# Altium schematic sheet MCU.SchDoc
size A4
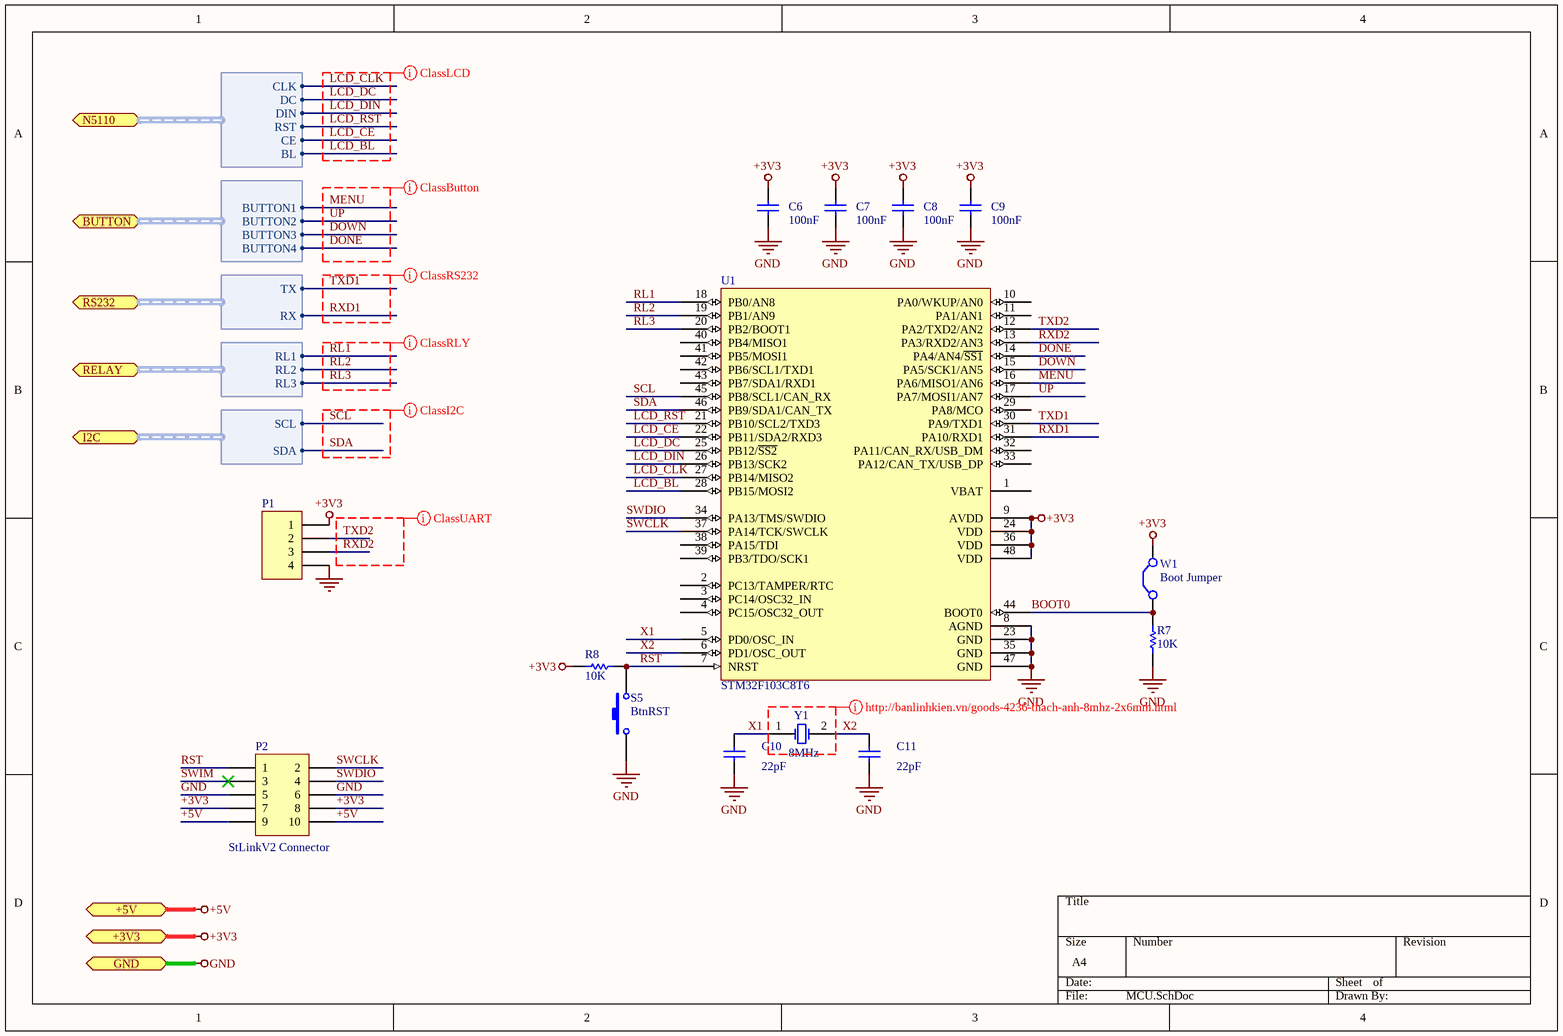
[diagram p0: MCU.SchDoc]

## Parts
C6  value 100nF  [C-0805]  (hidden comment: 104)
C7  value 100nF  [C-0805]  (hidden comment: 104)
C8  value 100nF  [C-0805]  (hidden comment: 104)
C9  value 100nF  [C-0805]  (hidden comment: 104)
C10  value 22pF  [C-0805]  (hidden comment: 22)
C11  value 22pF  [C-0805]  (hidden comment: 22)
P1  XH2.54-4P  [CONN-XH2.54-4P]  (value not drawn)
P2  value StLinkV2 Connector  [CONN-IDC-5X2-A]  (hidden comment: IDC5x2A)
R7  10K  [R-0805]
R8  10K  [R-0805]
S5  value BtnRST  [SW-T-S6]  (hidden comment: SW-T-S6)
U1  STM32F103C8T6  [LQFP-48]
W1  value Boot Jumper  [JP2.54-M-1x02A]  (hidden comment: JP2.54-M)
Y1  value 8MHz  [R38]  (hidden comment: 49S-8MHz)

## Ports
+3V3, +5V, BUTTON (harness BUTTON), GND, I2C (harness I2C), N5110 (harness N5110LCD), RELAY (harness RELAY), RS232 (harness RS232)

## Harnesses
N5110LCD: CLK, DC, DIN, RST, CE, BL
BUTTON: BUTTON1, BUTTON2, BUTTON3, BUTTON4
RS232: TX, RX
RELAY: RL1, RL2, RL3
I2C: SCL, SDA

## Nets
+3V3: C6.1 C7.1 C8.1 C9.1 P1.1 P2.7 P2.8 R8.2 U1.9(AVDD) U1.24(VDD) U1.36(VDD) U1.48(VDD) W1.2(C2) ; port +3V3
+5V: P2.9 P2.10 ; port +5V
GND: C6.2 C7.2 C8.2 C9.2 C10.2 C11.2 P1.4 P2.5 P2.6 R7.2 S5.1 U1.8(AGND) U1.23(GND) U1.35(GND) U1.47(GND) ; port GND
BOOT0: R7.1 U1.44(BOOT0) W1.1(C1)
DONE: U1.14(PA4/AN4/~{SS1}) ; port BUTTON.BUTTON4
DOWN: U1.15(PA5/SCK1/AN5) ; port BUTTON.BUTTON3
LCD_BL: U1.28(PB15/MOSI2) ; port N5110.BL
LCD_CE: U1.22(PB11/SDA2/RXD3) ; port N5110.CE
LCD_CLK: U1.27(PB14/MISO2) ; port N5110.CLK
LCD_DC: U1.25(PB12/~{SS2}) ; port N5110.DC
LCD_DIN: U1.26(PB13/SCK2) ; port N5110.DIN
LCD_RST: U1.21(PB10/SCL2/TXD3) ; port N5110.RST
MENU: U1.16(PA6/MISO1/AN6) ; port BUTTON.BUTTON1
RL1: U1.18(PB0/AN8) ; port RELAY.RL1
RL2: U1.19(PB1/AN9) ; port RELAY.RL2
RL3: U1.20(PB2/BOOT1) ; port RELAY.RL3
RST: P2.1 R8.1 S5.2 U1.7(NRST)
RXD1: U1.31(PA10/RXD1) ; port RS232.RX
RXD2: P1.3 U1.13(PA3/RXD2/AN3)
SCL: U1.45(PB8/SCL1/CAN_RX) ; port I2C.SCL
SDA: U1.46(PB9/SDA1/CAN_TX) ; port I2C.SDA
SWCLK: P2.2 U1.37(PA14/TCK/SWCLK)
SWDIO: P2.4 U1.34(PA13/TMS/SWDIO)
SWIM: P2.3
TXD1: U1.30(PA9/TXD1) ; port RS232.TX
TXD2: P1.2 U1.12(PA2/TXD2/AN2)
UP: U1.17(PA7/MOSI1/AN7) ; port BUTTON.BUTTON2
X1: C10.1 U1.5(PD0/OSC_IN) Y1.1(OSC1)
X2: C11.1 U1.6(PD1/OSC_OUT) Y1.2(OSC2)

Not connected (* = marked no-connect by the designer): U1 1(VBAT) 2(PC13/TAMPER/RTC) 3(PC14/OSC32_IN) 4(PC15/OSC32_OUT) 10(PA0/WKUP/AN0) 11(PA1/AN1) 29(PA8/MCO) 32(PA11/CAN_RX/USB_DM) 33(PA12/CAN_TX/USB_DP) 38(PA15/TDI) 39(PB3/TDO/SCK1) 40(PB4/MISO1) 41(PB5/MOSI1) 42(PB6/SCL1/TXD1) 43(PB7/SDA1/RXD1)

## Layout directives
net class LCD: LCD_BL, LCD_CE, LCD_CLK, LCD_DC, LCD_DIN, LCD_RST
net class BUTTON: DONE, DOWN, MENU, UP
net class RS232: RXD1, TXD1
net class RLY_CTRL: RL1, RL2, RL3
net class I2C: SCL, SDA
net class UART: (no net found under the mark), RXD2, TXD2

## Library data of the parts
C6-C11 = Cap: Capacitor; Published: 8-Jun-2000; LatestRevisionDate: 17-Jul-2002; LatestRevisionNote: Re-released for DXP Platform.; PackageReference: RAD-0.3; Publisher: Altium Limited
P1 = Header 4: Header, 4-Pin; Value: USART Connector; LatestRevisionDate: 17-Jul-2002; LatestRevisionNote: Re-released for DXP Platform.
P2 = Header 5X2: Header, 5-Pin, Dual row; LatestRevisionDate: 17-Jul-2002; LatestRevisionNote: Re-released for DXP Platform.
R7 R8 = Res1: Resistor; Published: 8-Jun-2000; LatestRevisionDate: 17-Jul-2002; LatestRevisionNote: Re-released for DXP Platform.; PackageReference: AXIAL-0.3; Publisher: Altium Limited; PackageDescription: Axial Device, Thru-Hole; 2 Leads; 0.3 in Pin Spacing; Value: 10K
S5 = SW-PB: Switch; Published: 24-Mar-1999; LatestRevisionDate: 17-Jul-2002; LatestRevisionNote: Re-released for DXP Platform.; PackageReference: SPST-2; PackageDescription: Switch; 2 Leads
U1 = STM32F103C8T6: 32bits STM32 48 Pins; Value: STM32F103C8T6
W1 = Jumper: Jumper Wire; Published: 24-Mar-1999; LatestRevisionDate: 17-Jul-2002; LatestRevisionNote: Re-released for DXP Platform.; PackageReference: RAD-0.2; PackageDescription: Radial Cap, Thru-Hole; 2 Leads; 0.2 in Pin Spacing
Y1 = XTAL: Crystal Oscillator; Published: 8-Jun-2000; LatestRevisionDate: 17-Jul-2002; LatestRevisionNote: Re-released for DXP Platform.; PackageReference: R38; PackageDescription: Crystal, Thru-Hole; 2 Leads; Body 3.1 x 8.2 mm (Dia.xH)